# EAGLE design ADS1299-shield (EAGLE 6.5.0)

## Sheet 1 of 2
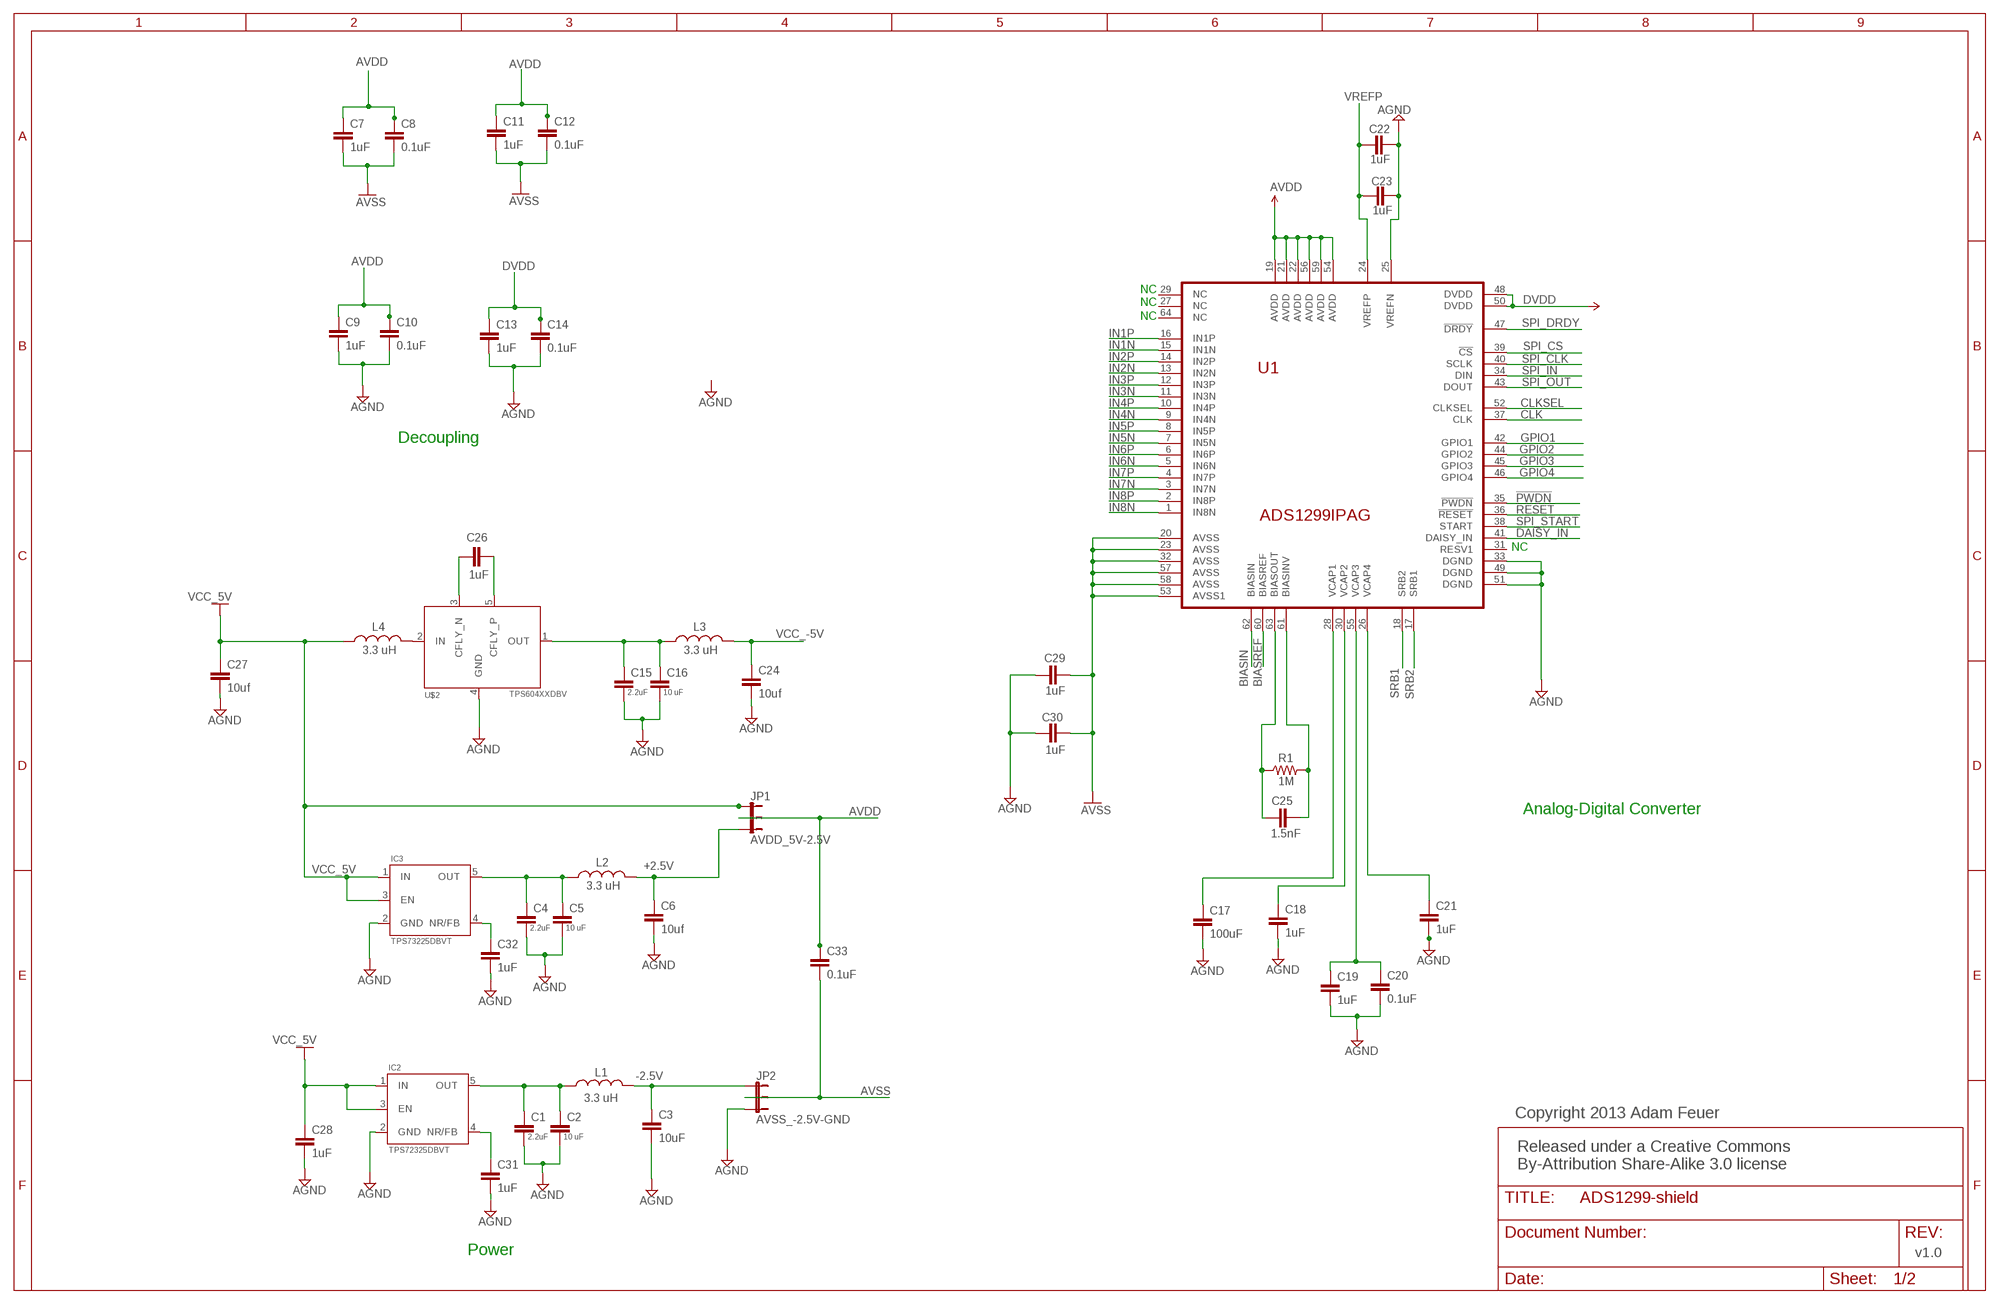
[diagram p0: schematic, sheet 1]

### Parts
C1  2.2uF  CAP0603-CAP  [0603-CAP]
C2  10 uF  CAP0603-CAP  [0603-CAP]
C3  10uF  CAP0603-CAP  [0603-CAP]
C4  2.2uF  CAP0603-CAP  [0603-CAP]
C5  10 uF  CAP0603-CAP  [0603-CAP]
C6  10uf  CAP0603-CAP  [0603-CAP]
C7  1uF  CAP0603-CAP  [0603-CAP]
C8  0.1uF  CAP0603-CAP  [0603-CAP]
C9  1uF  CAP0603-CAP  [0603-CAP]
C10  0.1uF  CAP0603-CAP  [0603-CAP]
C11  1uF  CAP0603-CAP  [0603-CAP]
C12  0.1uF  CAP0603-CAP  [0603-CAP]
C13  1uF  CAP0603-CAP  [0603-CAP]
C14  0.1uF  CAP0603-CAP  [0603-CAP]
C15  2.2uF  CAP0603-CAP  [0603-CAP]
C16  10 uF  CAP0603-CAP  [0603-CAP]
C17  100uF  CAP0603-CAP  [0603-CAP]
C18  1uF  CAP0603-CAP  [0603-CAP]
C19  1uF  CAP0603-CAP  [0603-CAP]
C20  0.1uF  CAP0603-CAP  [0603-CAP]
C21  1uF  CAP0603-CAP  [0603-CAP]
C22  1uF  CAP0603-CAP  [0603-CAP]
C23  1uF  CAP0603-CAP  [0603-CAP]
C24  10uf  CAP0603-CAP  [0603-CAP]
C25  1.5nF  CAP0603-CAP  [0603-CAP]
C26  1uF  CAP0603-CAP  [0603-CAP]
C27  10uf  CAP0603-CAP  [0603-CAP]
C28  1uF  CAP0603-CAP  [0603-CAP]
C29  1uF  CAP0603-CAP  [0603-CAP]
C30  1uF  CAP0603-CAP  [0603-CAP]
C31  1uF  CAP0603-CAP  [0603-CAP]
C32  1uF  CAP0603-CAP  [0603-CAP]
C33  0.1uF  CAP0603-CAP  [0603-CAP]
IC2  TPS72325DBVT  TPS732XXDBV  [SOT23-5]
IC3  TPS73225DBVT  TPS732XXDBV  [SOT23-5]
JP1  AVDD_5V-2.5V  JUMPER-3PTH  [1X03]
JP2  AVSS_-2.5V-GND  JUMPER-3PTH  [1X03]
L1  3.3 uH  INDUCTOR0603  [0603]
L2  3.3 uH  INDUCTOR0603  [0603]
L3  3.3 uH  INDUCTOR0603  [0603]
L4  3.3 uH  INDUCTOR0603  [0603]
R1  1M  RESISTOR0603-RES  [0603-RES]
U1  ADS1299IPAG  ADS1299*PAG*  [TQFP64]
U$2  TPS604XXDBV  [SOT23-5]

### Nets
!PWDN: U1.35(!PWDN)
!RESET: U1.36(!RESET)
+2.5V: C6.1 JP1.3 L2.2
-2.5V: C3.1 JP2.1 L1.2
AGND: C1.2 C2.2 C3.2 C4.2 C5.2 C6.2 C9.2 C10.2 C13.2 C14.2 C15.2 C16.2 C17.2 C18.2 C19.2 C20.2 C21.2 C22.2 C23.2 C24.2 C27.2 C28.2 C29.1 C30.1 C31.2 C32.2 IC2.2(GND) IC3.2(GND) JP2.3 U1.25(VREFN) U1.33(DGND) U1.49(DGND) U1.51(DGND) U$2.4(GND) ; also sheet 2
AVDD: C7.1 C8.1 C9.1 C10.1 C11.1 C12.1 C33.1 JP1.2 U1.19(AVDD) U1.21(AVDD) U1.22(AVDD) U1.54(AVDD) U1.56(AVDD) U1.59(AVDD)
AVSS: C11.2 C12.2 C29.2 C30.2 C33.2 JP2.2 U1.20(AVSS) U1.23(AVSS) U1.32(AVSS) U1.53(AVSS1) U1.57(AVSS) U1.58(AVSS)
BIASIN: U1.62(BIASIN)
BIASINV: C25.2 R1.2 U1.61(BIASINV)
BIASOUT: C25.1 R1.1 U1.63(BIASOUT)
BIASREF: U1.60(BIASREF)
CLK: U1.37(CLK)
CLKSEL: U1.52(CLKSEL)
DAISY_IN: U1.41(DAISY_IN)
DVDD: C13.1 C14.1 U1.48(DVDD) U1.50(DVDD)
GND: C7.2 C8.2 ; supply symbol labelled AVSS
GPIO1: U1.42(GPIO1)
GPIO2: U1.44(GPIO2)
GPIO3: U1.45(GPIO3)
GPIO4: U1.46(GPIO4)
IN1N: U1.15(IN1N) ; also sheet 2
IN1P: U1.16(IN1P) ; also sheet 2
IN2N: U1.13(IN2N) ; also sheet 2
IN2P: U1.14(IN2P)
IN3N: U1.11(IN3N)
IN3P: U1.12(IN3P) ; also sheet 2
IN4N: U1.9(IN4N) ; also sheet 2
IN4P: U1.10(IN4P) ; also sheet 2
IN5N: U1.7(IN5N) ; also sheet 2
IN5P: U1.8(IN5P) ; also sheet 2
IN6N: U1.5(IN6N) ; also sheet 2
IN6P: U1.6(IN6P) ; also sheet 2
IN7N: U1.3(IN7N) ; also sheet 2
IN7P: U1.4(IN7P) ; also sheet 2
IN8N: U1.1(IN8N) ; also sheet 2
IN8P: U1.2(IN8P) ; also sheet 2
N$1: C4.1 C5.1 IC3.5(OUT) L2.1
N$2: C1.1 C2.1 IC2.5(OUT) L1.1
N$3: C17.1 U1.28(VCAP1)
N$4: C18.1 U1.30(VCAP2)
N$5: C19.1 C20.1 U1.55(VCAP3)
N$7: C15.1 C16.1 L3.1 U$2.1(OUT)
N$8: C21.1 U1.26(VCAP4)
N$9: C26.2 U$2.5(CFLY_P)
N$10: C26.1 U$2.3(CFLY_N)
N$11: C32.1 IC3.4(NR/FB)
N$12: L4.2 U$2.2(IN)
N$13: C31.1 IC2.4(NR/FB)
SPI_CLK: U1.40(SCLK)
SPI_CS: U1.39(!CS)
SPI_DRDY: U1.47(!DRDY)
SPI_IN: U1.34(DIN)
SPI_OUT: U1.43(DOUT)
SPI_START: U1.38(START)
SRB1: U1.18(SRB2)
SRB2: U1.17(SRB1)
VCC_5V: C27.1 IC3.1(IN) IC3.3(EN) JP1.1 L4.1
VCC_-5V: C24.1 C28.1 IC2.1(IN) IC2.3(EN) L3.2 ; supply symbol labelled VCC_5V
VREFP: C22.1 C23.1 U1.24(VREFP)
Unconnected: U1.27(NC) U1.29(NC) U1.31(RESV1) U1.64(NC)

### Notes on the sheet
- NC
- NC
- NC
- Decoupling
- NC
- Analog-Digital Converter
- Copyright 2013 Adam Feuer
- Released under a Creative Commons 
  By-Attribution Share-Alike 3.0 license
- Power | v1.0

## Sheet 2 of 2
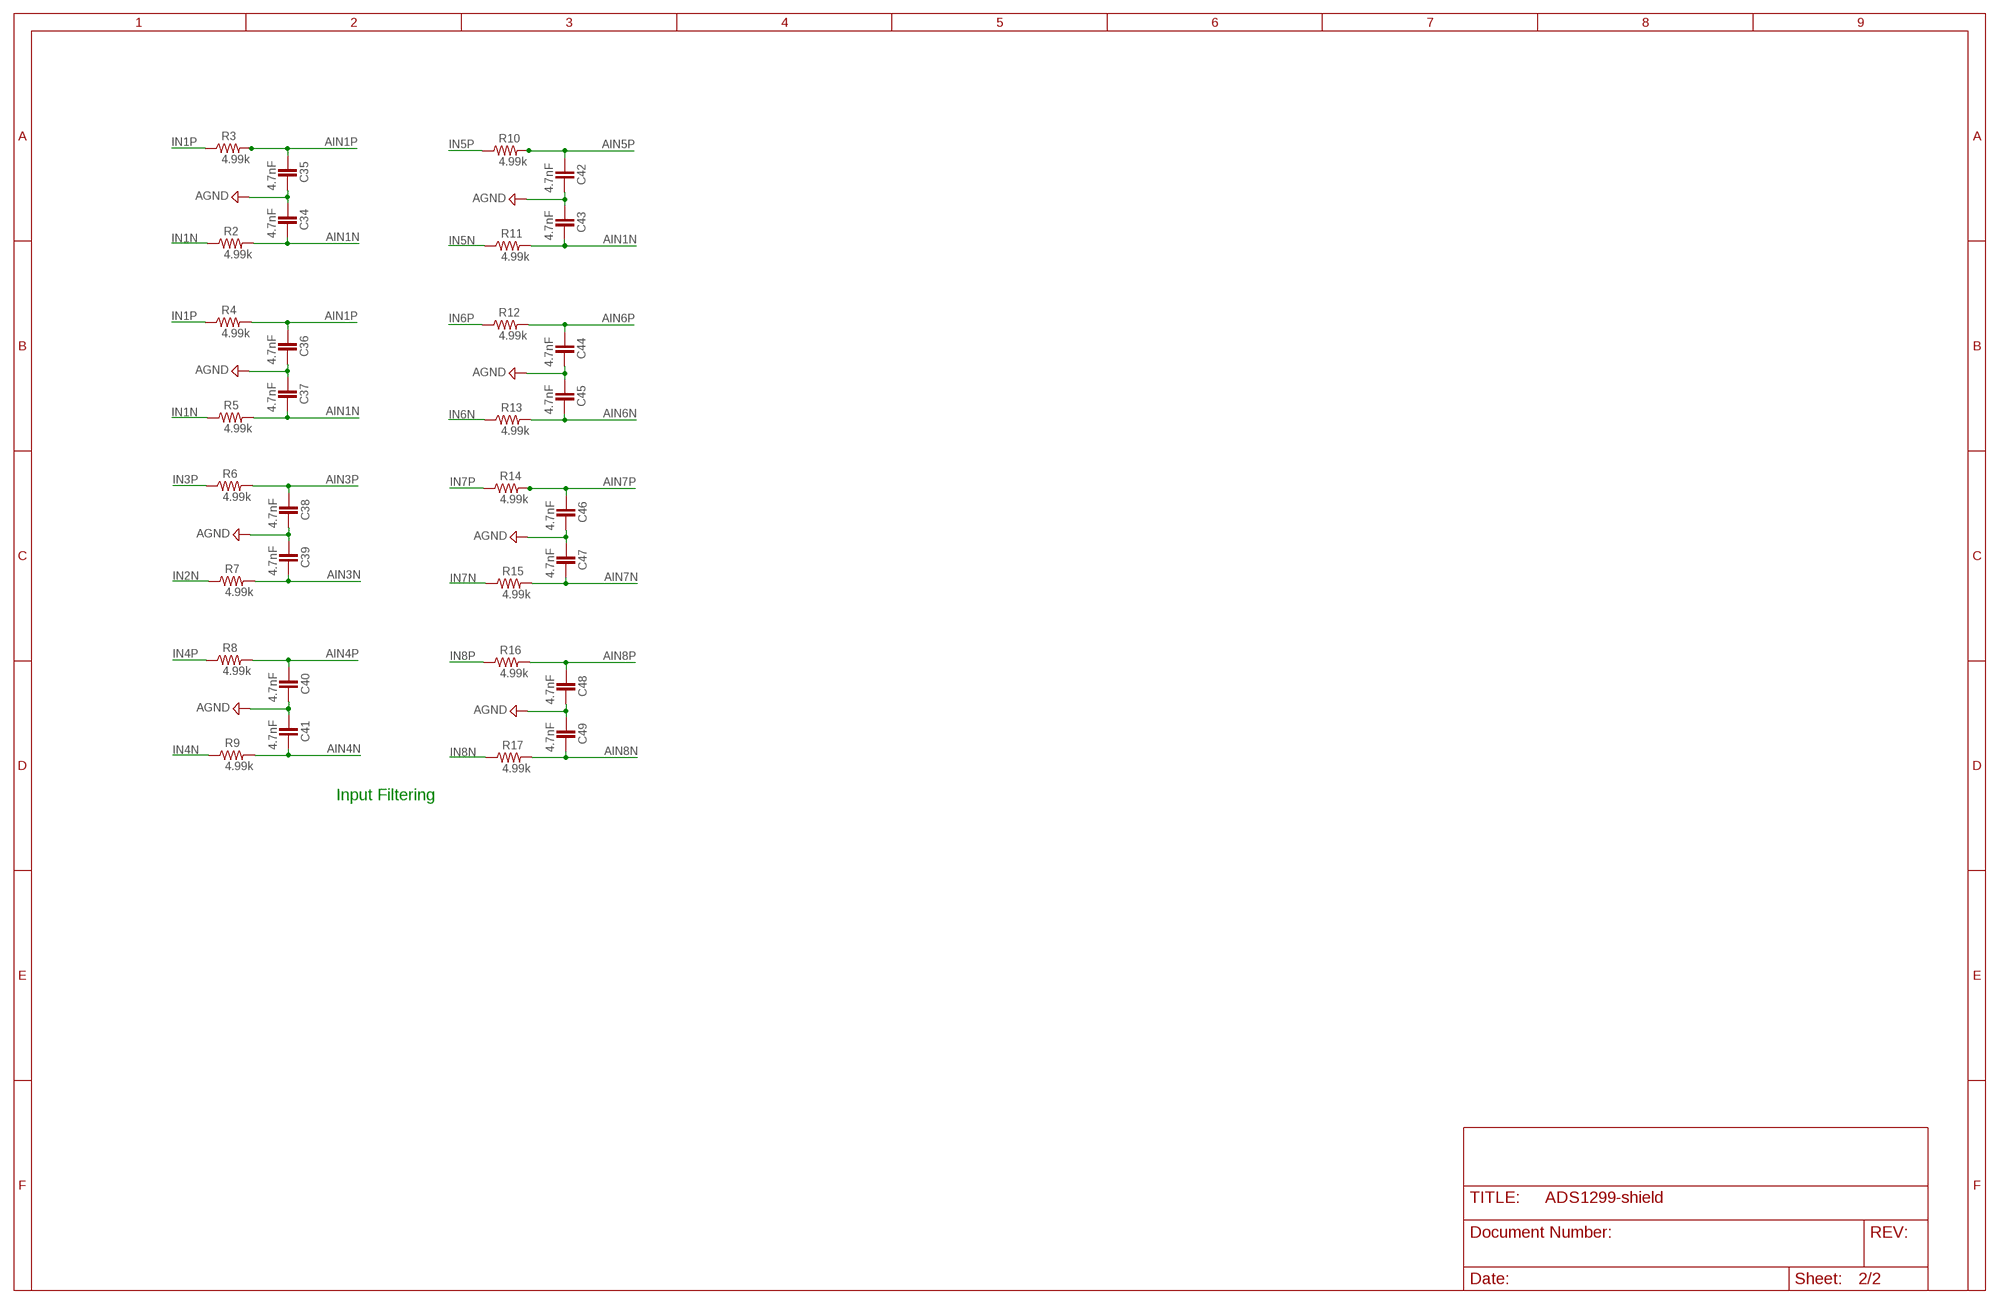
[diagram p1: schematic, sheet 2]

### Parts
C34  4.7nF  CAP0603-CAP  [0603-CAP]
C35  4.7nF  CAP0603-CAP  [0603-CAP]
C36  4.7nF  CAP0603-CAP  [0603-CAP]
C37  4.7nF  CAP0603-CAP  [0603-CAP]
C38  4.7nF  CAP0603-CAP  [0603-CAP]
C39  4.7nF  CAP0603-CAP  [0603-CAP]
C40  4.7nF  CAP0603-CAP  [0603-CAP]
C41  4.7nF  CAP0603-CAP  [0603-CAP]
C42  4.7nF  CAP0603-CAP  [0603-CAP]
C43  4.7nF  CAP0603-CAP  [0603-CAP]
C44  4.7nF  CAP0603-CAP  [0603-CAP]
C45  4.7nF  CAP0603-CAP  [0603-CAP]
C46  4.7nF  CAP0603-CAP  [0603-CAP]
C47  4.7nF  CAP0603-CAP  [0603-CAP]
C48  4.7nF  CAP0603-CAP  [0603-CAP]
C49  4.7nF  CAP0603-CAP  [0603-CAP]
R2  4.99k  RESISTOR0603-RES  [0603-RES]
R3  4.99k  RESISTOR0603-RES  [0603-RES]
R4  4.99k  RESISTOR0603-RES  [0603-RES]
R5  4.99k  RESISTOR0603-RES  [0603-RES]
R6  4.99k  RESISTOR0603-RES  [0603-RES]
R7  4.99k  RESISTOR0603-RES  [0603-RES]
R8  4.99k  RESISTOR0603-RES  [0603-RES]
R9  4.99k  RESISTOR0603-RES  [0603-RES]
R10  4.99k  RESISTOR0603-RES  [0603-RES]
R11  4.99k  RESISTOR0603-RES  [0603-RES]
R12  4.99k  RESISTOR0603-RES  [0603-RES]
R13  4.99k  RESISTOR0603-RES  [0603-RES]
R14  4.99k  RESISTOR0603-RES  [0603-RES]
R15  4.99k  RESISTOR0603-RES  [0603-RES]
R16  4.99k  RESISTOR0603-RES  [0603-RES]
R17  4.99k  RESISTOR0603-RES  [0603-RES]

### Nets
AGND: C34.1 C35.2 C36.2 C37.1 C38.2 C39.1 C40.2 C41.1 C42.2 C43.1 C44.2 C45.1 C46.2 C47.1 C48.2 C49.1 ; also sheet 1
AIN1N: C34.2 C37.2 C43.2 R2.2 R5.2 R11.2
AIN1P: C35.1 C36.1 R3.2 R4.2
AIN3N: C39.2 R7.2
AIN3P: C38.1 R6.2
AIN4N: C41.2 R9.2
AIN4P: C40.1 R8.2
AIN5P: C42.1 R10.2
AIN6N: C45.2 R13.2
AIN6P: C44.1 R12.2
AIN7N: C47.2 R15.2
AIN7P: C46.1 R14.2
AIN8N: C49.2 R17.2
AIN8P: C48.1 R16.2
IN1N: R2.1 R5.1 ; also sheet 1
IN1P: R3.1 R4.1 ; also sheet 1
IN2N: R7.1 ; also sheet 1
IN3P: R6.1 ; also sheet 1
IN4N: R9.1 ; also sheet 1
IN4P: R8.1 ; also sheet 1
IN5N: R11.1 ; also sheet 1
IN5P: R10.1 ; also sheet 1
IN6N: R13.1 ; also sheet 1
IN6P: R12.1 ; also sheet 1
IN7N: R15.1 ; also sheet 1
IN7P: R14.1 ; also sheet 1
IN8N: R17.1 ; also sheet 1
IN8P: R16.1 ; also sheet 1

### Notes on the sheet
- Input Filtering

## Library data of the parts
C1-C49 = SparkFun-Passives:CAP: Capacitor Standard 0603 ceramic capacitor, and 0.1" leaded capacitor.
IC2 IC3 = TPS32xx:TPS732XX: Cap-Free, NMOS, 250mA Low Dropout Regulator with Reverse Current Protection
JP1 JP2 = SparkFun-Passives:JUMPER-3
L1-L4 = SparkFun-Passives:INDUCTOR: Inductors Basic Inductor/Choke - 0603 and 1206. Footprints are not proven and vary greatly between part numbers. SRN6045- 33uH, 20% 1.4A
R1-R17 = SparkFun-Passives:RESISTOR: Resistor Basic schematic elements and footprints for 0603, 1206, and PTH resistors.
U1 = ADS129x:ADS1299: 8-Channel, 24-Bit Analog-To-Digital Converter With Integrated EEG Front End. ADS1299 modifications by Adam Feuer (adam@adamfeuer.com) Based on ADS1298: Drawn 23.07.2011 by Tomasz Boleslaw CEDRO (http://www.tomek.cedro.info).
U$2 = TPS604xx:TPS604XX: 60mA Charge Pump Voltage Inverter with Fixed 250kHz Operation

## Board
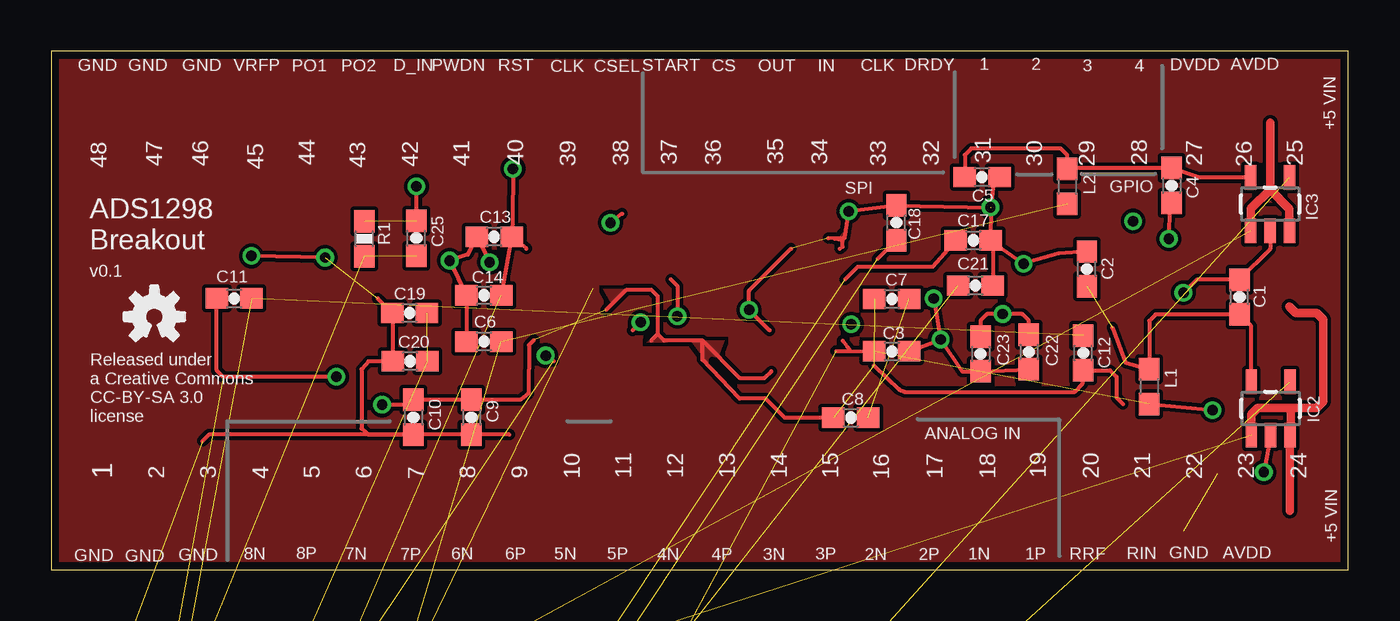
[diagram p2: board, top side]
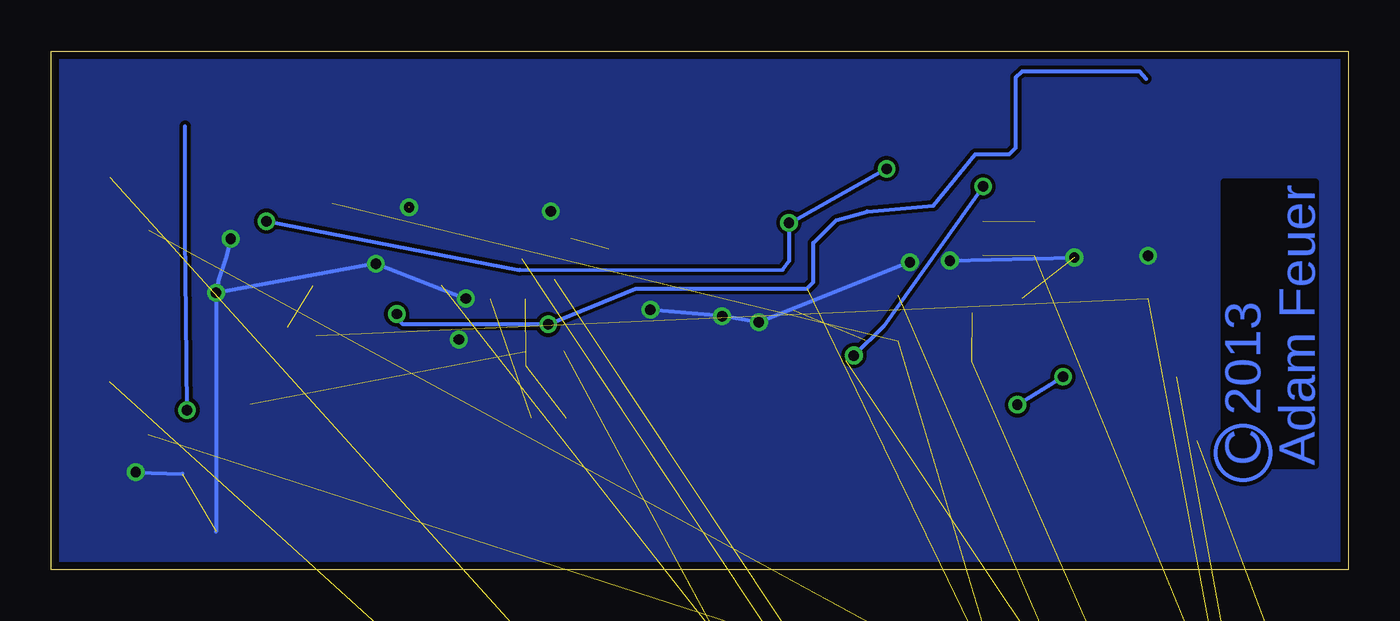
[diagram p3: board, bottom side, seen from below]

Size 63.5 x 25.4 mm. Coordinates in mm from the lower left corner, seen from the top.
Outline: 0,0 63.5,0 63.5,25.4 0,25.4 0,0
Copper layers (1*16): Top 0.0356mm / dielectric 1.5011mm / Bottom 0.0356mm
Design rules "APCircuits": minimum track width 8mil, minimum drill 13mil, track to track 7mil, track to pad 7mil, pad to pad 7mil, via to via 7mil, smd to smd 7mil, copper to edge 15mil, drill to drill 7mil, minimum pad ring 7mil, minimum via ring 7mil, stop-mask expansion 4mil, vias tented up to drill 0mil, thermal gap 10mil

### Footprints (pad centres in the part's own frame; a part is rotated, then mirrored left to right if it is on the bottom)
0603-CAP = smd 1.1 x 1: 1 -0.85,0; 2 0.85,0
SOT23-5 = smd 0.55 x 1.2: 1 -0.95,-1.3; 2 0,-1.3; 3 0.95,-1.3; 4 0.95,1.3; 5 -0.95,1.3
1X03 = drill 1.016 pad 1.88: 1 0,0; 2 2.54,0; 3 5.08,0
0603 = smd 1.1 x 1: 1 -0.85,0; 2 0.85,0
0603-RES = smd 1.1 x 1: 1 -0.85,0; 2 0.85,0
TQFP64 = smd 1.5 x 0.285: 1 -5.85,3.75; 2 -5.85,3.25; 3 -5.85,2.75; 4 -5.85,2.25; 5 -5.85,1.75; 6 -5.85,1.25; 7 -5.85,0.75; 8 -5.85,0.25; 9 -5.85,-0.25; 10 -5.85,-0.75; 11 -5.85,-1.25; 12 -5.85,-1.75; 13 -5.85,-2.25; 14 -5.85,-2.75; 15 -5.85,-3.25; 16 -5.85,-3.75; 33 5.85,-3.75; 34 5.85,-3.25; 35 5.85,-2.75; 36 5.85,-2.25; 37 5.85,-1.75; 38 5.85,-1.25; 39 5.85,-0.75; 40 5.85,-0.25; 41 5.85,0.25; 42 5.85,0.75; 43 5.85,1.25; 44 5.85,1.75; 45 5.85,2.25; 46 5.85,2.75; 47 5.85,3.25; 48 5.85,3.75 | smd 0.285 x 1.5: 17 -3.75,-5.85; 18 -3.25,-5.85; 19 -2.75,-5.85; 20 -2.25,-5.85; 21 -1.75,-5.85; 22 -1.25,-5.85; 23 -0.75,-5.85; 24 -0.25,-5.85; 25 0.25,-5.85; 26 0.75,-5.85; 27 1.25,-5.85; 28 1.75,-5.85; 29 2.25,-5.85; 30 2.75,-5.85; 31 3.25,-5.85; 32 3.75,-5.85; 49 3.75,5.85; 50 3.25,5.85; 51 2.75,5.85; 52 2.25,5.85; 53 1.75,5.85; 54 1.25,5.85; 55 0.75,5.85; 56 0.25,5.85; 57 -0.25,5.85; 58 -0.75,5.85; 59 -1.25,5.85; 60 -1.75,5.85; 61 -2.25,5.85; 62 -2.75,5.85; 63 -3.25,5.85; 64 -3.75,5.85

### Placement (x,y rotation side)
C1  58.17,13.36 90 top
C2  50.7,14.73 90 top
C3  41.15,10.69 0 top
C4  54.84,18.82 270 top
C5  45.57,19.23 0 top
C6  21.18,11.18 180 top
C7  41.15,13.26 0 top
C8  39.14,7.44 0 top
C9  20.57,7.47 270 top
C10  17.73,7.47 270 top
C11  8.97,13.28 0 top
C12  50.52,10.62 90 top
C13  21.69,16.31 180 top
C14  21.18,13.44 180 top
C15  -2.54,-7.87 0 top  (outside the outline)
C16  1.27,-7.87 0 top  (outside the outline)
C17  45.14,16.13 0 top
C18  41.38,16.99 90 top
C19  17.55,12.57 180 top
C20  17.58,10.21 180 top
C21  45.24,13.92 0 top
C22  47.85,10.67 270 top
C23  45.49,10.57 270 top
C24  -2.54,-11.68 0 top  (outside the outline)
C25  17.88,16.23 90 top
C26  -6.35,-15.49 0 top  (outside the outline)
C27  -6.35,-23.11 0 top  (outside the outline)
C28  -6.35,-26.92 0 top  (outside the outline)
C29  -6.35,-44.7 0 top  (outside the outline)
C30  -6.35,-48.51 0 top  (outside the outline)
C31  -6.35,-52.32 0 top  (outside the outline)
C32  -6.35,-56.13 0 top  (outside the outline)
C33  -6.35,-75.18 0 top  (outside the outline)
C34  -6.35,-98.04 0 top  (outside the outline)
C35  -6.35,-86.61 0 top  (outside the outline)
C36  -6.35,-101.85 0 top  (outside the outline)
C37  -2.54,-101.85 0 top  (outside the outline)
C38  -6.35,-109.47 0 top  (outside the outline)
C39  -2.54,-109.47 0 top  (outside the outline)
C40  1.27,-109.47 0 top  (outside the outline)
C41  -6.35,-113.28 0 top  (outside the outline)
C42  -6.35,-120.9 0 top  (outside the outline)
C43  -2.54,-120.9 0 top  (outside the outline)
C44  1.27,-120.9 0 top  (outside the outline)
C45  5.08,-120.9 0 top  (outside the outline)
C46  -6.35,-124.71 0 top  (outside the outline)
C47  -2.54,-124.71 0 top  (outside the outline)
C48  1.27,-124.71 0 top  (outside the outline)
C49  5.08,-124.71 0 top  (outside the outline)
IC2  59.69,7.9 0 top
IC3  59.66,17.91 0 top
JP1  -5.08,-62.48 0 top  (outside the outline)
JP2  -5.08,-70.1 0 top  (outside the outline)
L1  53.75,8.97 270 top
L2  49.73,18.77 270 top
L3  1.27,-11.68 0 top  (outside the outline)
L4  -6.35,-19.3 0 top  (outside the outline)
R1  15.34,16.21 90 top
R2  -6.35,-94.23 0 top  (outside the outline)
R3  -6.35,-90.42 0 top  (outside the outline)
R4  -6.35,-105.66 0 top  (outside the outline)
R5  -2.54,-105.66 0 top  (outside the outline)
R6  -2.54,-113.28 0 top  (outside the outline)
R7  1.27,-113.28 0 top  (outside the outline)
R8  -6.35,-117.09 0 top  (outside the outline)
R9  -2.54,-117.09 0 top  (outside the outline)
R10  -6.35,-128.52 0 top  (outside the outline)
R11  -2.54,-128.52 0 top  (outside the outline)
R12  1.27,-128.52 0 top  (outside the outline)
R13  5.08,-128.52 0 top  (outside the outline)
R14  -6.35,-132.33 0 top  (outside the outline)
R15  -2.54,-132.33 0 top  (outside the outline)
R16  1.27,-132.33 0 top  (outside the outline)
R17  5.08,-132.33 0 top  (outside the outline)
U1  0,-35.81 0 top  (outside the outline)
U$1  [OSHW-LOGO-S]  5.05,12.4 0 top
U$2  -6.35,-10.41 0 top  (outside the outline)

### Tracks (layer width: path | path; a pad name or v marks a point on that pad's centre or on a via)
+2.5V  (2 unrouted)
-2.5V  (via drill 0.51)  (2 unrouted)
  Top 0.203: 38.42,10.71 39.14,10.71 | 39.14,10.71 C3.1 | L1.2 v56.84,7.82 | 38.73,11.23 38.96,10.93 39.14,10.71
  Bottom 0.203: v56.84,7.82 56.9,12.37 56.95,16.38 56.95,21.72
AGND  (via drill 0.51)  (35 unrouted)
  Top 0.203: IC3.2 59.66,15.71 C1.2 56.07,14.21 v55.42,13.56 | IC2.2 v59.36,4.78 | C4.2 54.85,17.93 54.74,17.82 v54.71,16.2 | C5.2 46.11,18.92 46.01,17.73 | 46.01,17.73 C17.2 | C2.2 49.31,15.49 v47.6,14.99 C17.2 | C3.2 v43.54,11.28 | 46.01,17.73 C18.2 v39.04,17.55 38.84,16.26 | 38.84,16.26 38.05,16.23 38.35,16.21 38.73,16.13 | 22.43,6.62 C9.2 C10.2 | 15.99,13.28 C19.2 16.73,12.55 C20.2 15.53,10.21 15.19,9.82 15.19,6.91 15.53,6.62 C10.2 | 36.22,15.72 34.16,13.67 v34.16,12.72 35.17,11.72 | 28.46,11.72 v28.85,12.12 28.75,12.22 | v13.41,15.29 v9.8,15.37 | C6.2 C14.2 v19.51,15.14 20.4,15.43 C13.2 v21.46,15.06 | C17.2 46.09,16.13 C21.2 | v43.54,11.28 44.59,9.72 C23.2 C22.2 | v43.2,13.28 v43.54,11.28 | 30.34,14.22 30.66,13.9 v30.66,12.42 | C10.2 7.73,6.62 7.42,6.3 | 38.61,15.72 38.73,15.82 38.73,16.13 | 38.84,16.26 38.73,16.13
  Bottom 0.203: v59.36,4.78 57.07,4.7 | v55.42,13.56 55.42,1.88 | v55.42,13.56 v47.6,14.99 v43.2,13.28 | v54.71,16.2 54.95,15.24 55.3,14.24 v55.42,13.56 | v34.16,12.72 v30.66,12.42 v28.85,12.12 v21.46,15.06 | v19.51,15.14 v13.41,15.29
  other vias: 45.97,17.75
  pour Bottom (rank 6): 0,25.4 0,-0.03 63.5,0 63.5,25.4
  pour Top: 38.79,16.54 38.53,16.26 38.84,16.03
AIN1N  (5 unrouted)
AIN1P  (3 unrouted)
AIN3N  (1 unrouted)
AIN3P  (1 unrouted)
AIN4N  (1 unrouted)
AIN4P  (1 unrouted)
AIN5P  (1 unrouted)
AIN6N  (1 unrouted)
AIN6P  (1 unrouted)
AIN7N  (1 unrouted)
AIN7P  (1 unrouted)
AIN8N  (1 unrouted)
AIN8P  (1 unrouted)
AVDD  (via drill 0.51)  (11 unrouted)
  Top 0.203: 29.69,11.54 29.69,13.4 29.38,13.72 28.17,13.72 27.17,12.72 | 29.69,11.54 29.38,11.22 | 23.64,11.25 23.39,11.01 23.37,8.63 22.97,8.32 C9.1 C10.1 17.66,8.08 v16.2,8.08 | 31.88,11.22 30.01,11.22 29.69,11.54 | 40.27,10 41.51,8.84 41.76,8.71 50.1,8.71 50.49,9.13 C12.1 51.83,9.77 52.15,9.45 52.15,8.43 52.46,8.12 | v13.97,9.45 8.43,9.45 8.12,9.77 C11.1 | 35.25,9.72 34.9,9.37 33.73,9.37 31.88,11.22 | C8.1 35.92,7.44 34.98,8.38 33.71,8.38 31.88,10.29 31.88,11.22
  Bottom 0.203: v16.2,8.08 v13.97,9.45
  pour Top: 27.43,13 28.19,13.74 27.03,13.74
  pour Top: 29.13,11.13 30.15,11.13 29.69,11.51
  pour Top: 31.29,11.23 32.18,10.06 32.18,10.31 32.31,10.44 32.64,10.36 32.97,11.23
  pour Top: 38.94,10.69 38.99,11.05 38.76,11.1 38.76,10.87 38.63,10.79
AVSS  (11 unrouted)
BIASINV  (via drill 0.51)  (2 unrouted)
  Top 0.203: C25.2 v17.88,18.77 | v24.21,10.49 24.6,10.22
  Bottom 0.203: v17.88,18.77 22.76,11.91 v24.21,10.49
BIASOUT  (2 unrouted)
DVDD  (via drill 0.51)  (2 unrouted)
  Top 0.203: 23.27,15.72 C13.1 | C13.1 C14.1 | 27.95,17.43 v27.38,16.99 | v22.61,19.63 22.59,17.06 C13.1
  Bottom 0.203: v52.96,17.07 40.56,14.68 27.69,14.7 27.38,15.14 v27.38,16.99 27.33,16.97 v22.61,19.63
GND  (1 unrouted)
IN1N  (2 unrouted)
IN1P  (2 unrouted)
IN2N  (1 unrouted)
IN3P  (1 unrouted)
IN4N  (1 unrouted)
IN4P  (1 unrouted)
IN5N  (1 unrouted)
IN5P  (1 unrouted)
IN6N  (1 unrouted)
IN6P  (1 unrouted)
IN7N  (1 unrouted)
IN7P  (1 unrouted)
IN8N  (1 unrouted)
IN8P  (1 unrouted)
N$1
  Top 0.203: IC3.5 56.19,19.21 C4.1 49.78,19.67 L2.1 49.73,20.31 49.42,20.62 45.03,20.62 44.72,20.31 C5.1
N$2  (1 unrouted)
  Top 0.203: IC2.5 58.74,11.94 C1.1 54.06,12.51 53.75,12.19 L1.1 52.59,10.15 51.94,11.86
N$3  (1 unrouted)
  Top 0.203: C17.1 43.14,14.83 39.47,14.83 38.86,14.22
N$4  (1 unrouted)
  Top 0.203: C18.1 40.45,15.22
N$5  (2 unrouted)
N$6
  pour Top (rank 6): 0,25.4 0,0 63.5,0 63.5,25.4
N$7  (3 unrouted)
N$8  (1 unrouted)
N$9  (1 unrouted)
N$10  (1 unrouted)
N$11  (1 unrouted)
N$12  (1 unrouted)
N$13  (1 unrouted)
VCC
  pour Top: 59.97,7.92 60.68,7.37 61.52,7.92
  pour Top: 59.03,17.98 60.25,17.98 59.66,18.57
VCC_5V  (3 unrouted)
  Top 0.406: 59.66,21.89 59.66,18.62 | 59.66,18.62 58.73,17.68 58.73,16.62 IC3.1 | IC3.3 60.62,17.67 59.66,18.62
VCC_-5V  (3 unrouted)
  Top 0.406: 60.62,12.89 60.93,12.57 61.96,12.57 62.28,12.26 62.28,8.24 61.96,7.93 60.68,7.93 | 60.68,7.93 59.06,7.93 58.74,7.61 IC2.1 | 60.68,7.93 60.68,6.64 IC2.3 60.64,2.88
VREFP  (via drill 0.51)  (1 unrouted)
  Top 0.203: 38.96,12.22 v39.17,12.01 | C23.1 45.49,12.21 45.81,12.52 v46.58,12.52 47.54,12.52 47.85,12.21 C22.1
  Bottom 0.203: 9.91,24.04 10.22,24.41 15.96,24.41 16.28,24.12 16.28,20.66 16.6,20.34 18.26,20.34 20.32,17.83 23.55,17.55 25.07,17.12 26.19,16 26.19,14.08 26.5,13.77 34.87,13.77 v39.17,12.01 46.27,12.01 46.58,12.33 v46.58,12.52
(copper drawn outside any net)
  shapes: Bottom circle x1

### Text on the board
Bottom: C 2013 / Adam Feuer
tPlace: GND | GND | GND | VRFP | PO1 | PO2 | D_IN | PWDN | RST | CLK | CSEL | START | CS | OUT | IN | CLK | DRDY | 1 | 2 | 3 | 4 | DVDD | AVDD | +5 VIN | SPI | GPIO | ADS1298 / Breakout | v0.1 | Released under / a Creative Commons / CC-BY-SA 3.0 / license | ANALOG IN | +5 VIN | GND | GND | GND | 8N | 8P | 7N | 7P | 6N | 6P | 5N | 5P | 4N | 4P | 3N | 3P | 2N | 2P | 1N | 1P | RRF | RIN | GND | AVDD
tNames: 48 | 47 | 46 | 45 | 44 | 43 | 42 | 41 | 40 | 39 | 38 | 37 | 36 | 35 | 34 | 33 | 32 | 31 | 30 | 29 | 28 | 27 | 26 | 25 | 1 | 2 | 3 | 4 | 5 | 6 | 7 | 8 | 9 | 10 | 11 | 12 | 13 | 14 | 15 | 16 | 17 | 18 | 19 | 20 | 21 | 22 | 23 | 24